# EAGLE design pcb_telemetria (EAGLE 9.4.2)
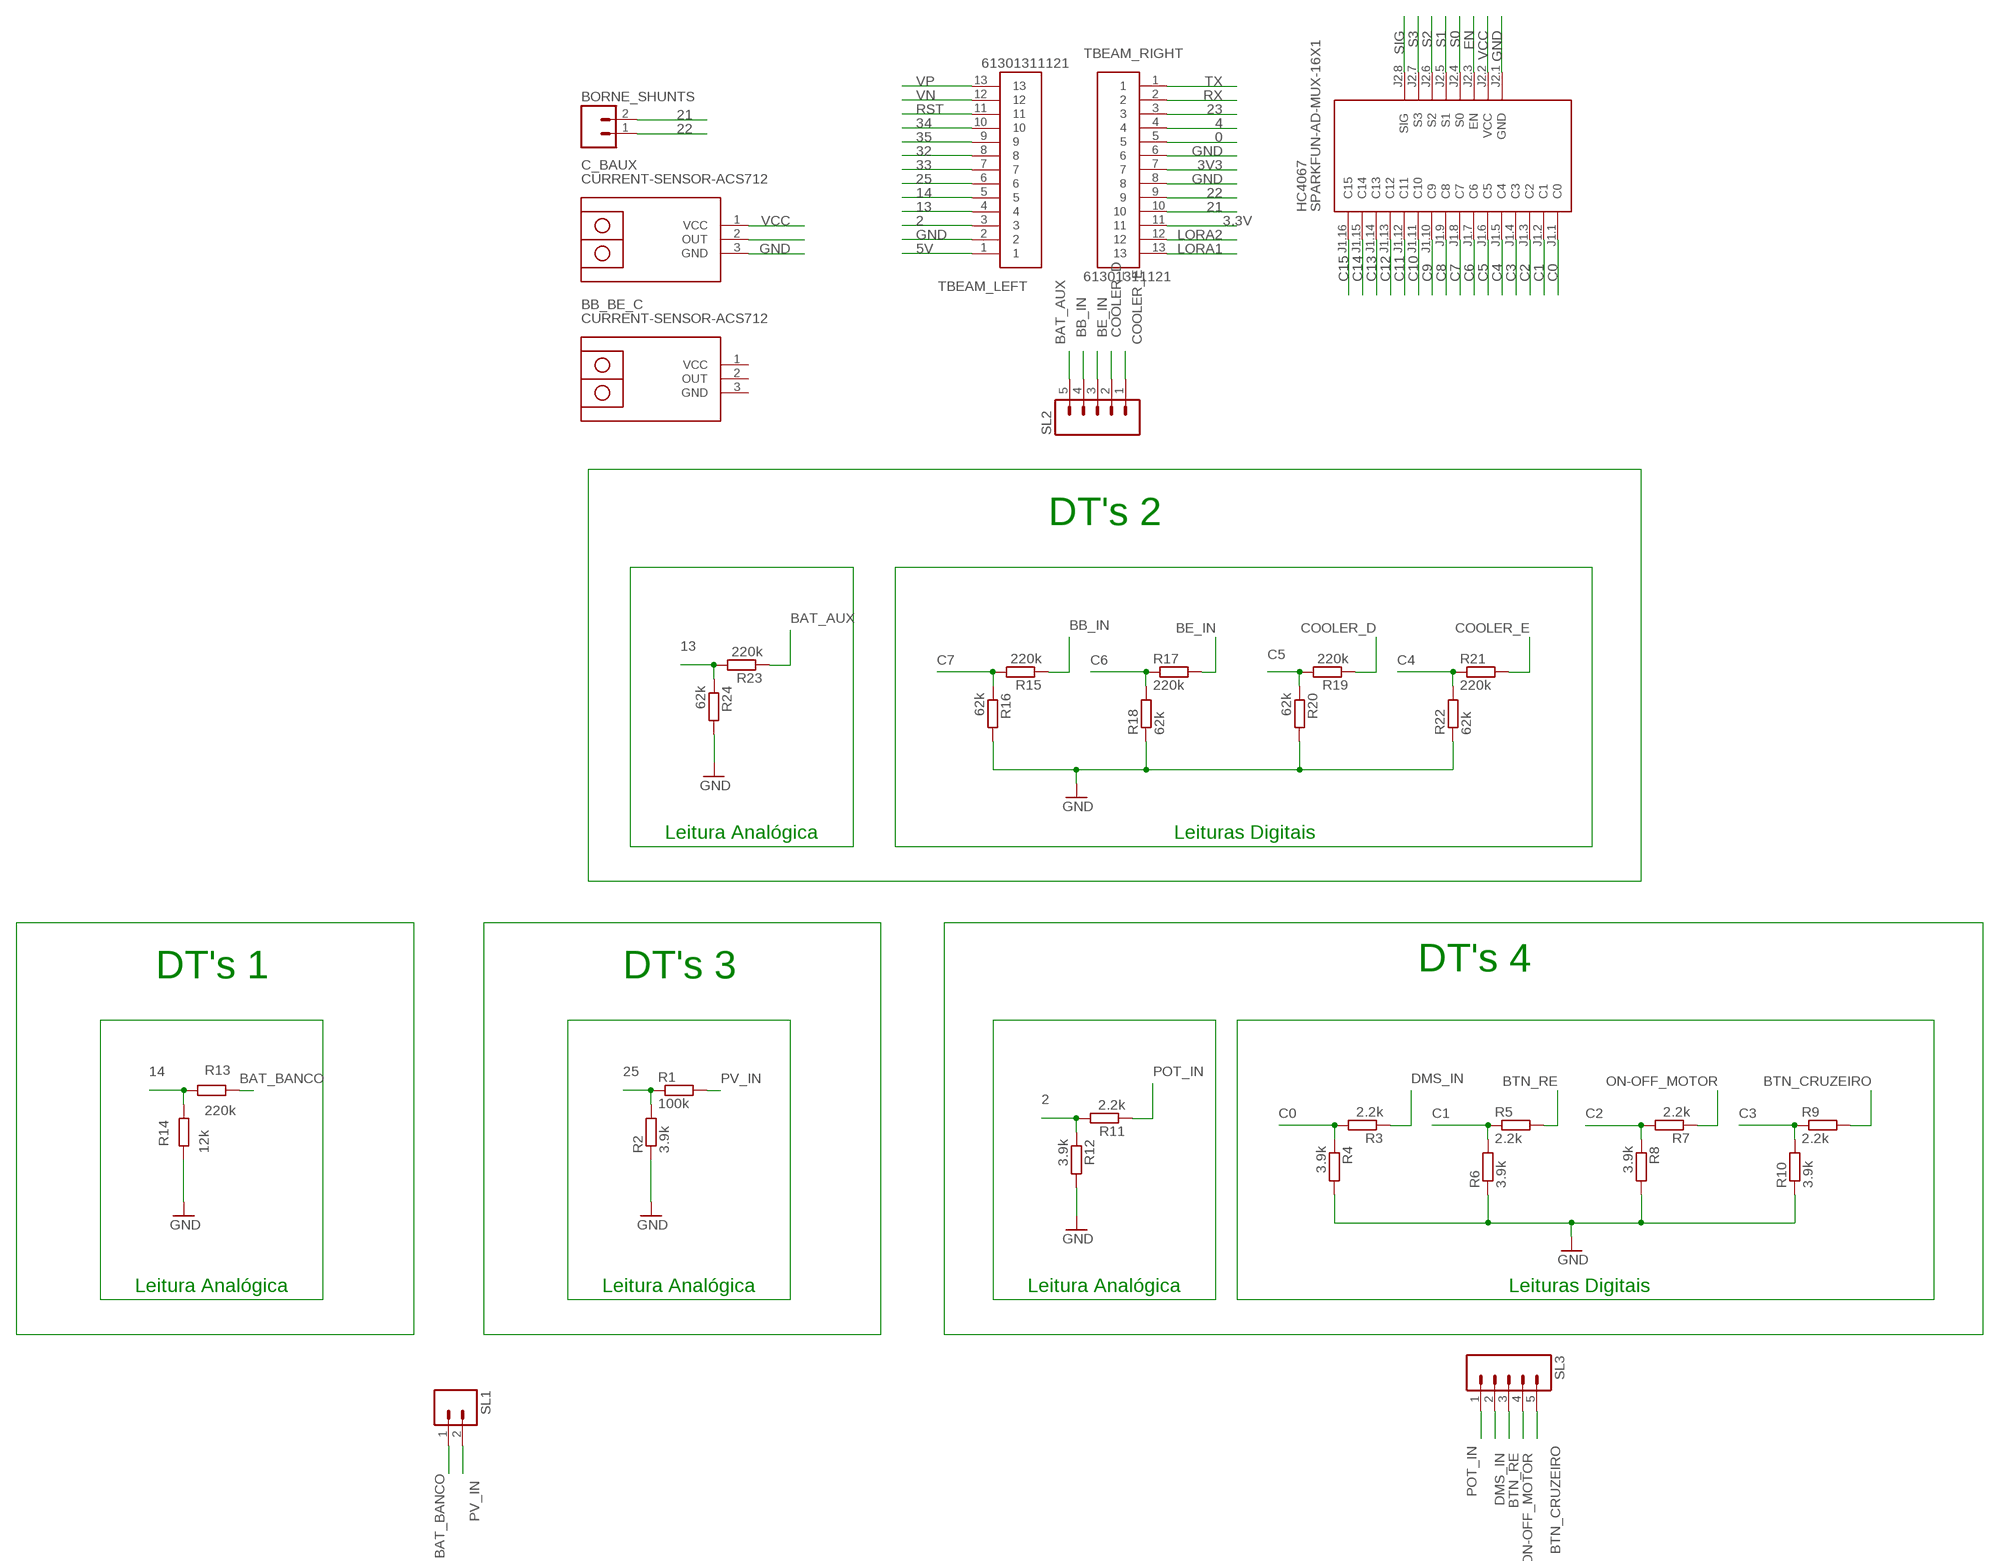
[diagram p0: schematic, sheet 1]

## Parts
BB_BE_C  CURRENT-SENSOR-ACS712  [CURRENT-SENSOR-ACS712]
BORNE_SHUNTS  M02  [02P]
C_BAUX  CURRENT-SENSOR-ACS712  [CURRENT-SENSOR-ACS712]
HC4067  SPARKFUN-AD-MUX-16X1  [SPARKFUN-AD-MUX-16X1]
R1  100k  R-EU_0204/7  [0204/7]
R2  3.9k  R-EU_0204/7  [0204/7]
R3  2.2k  R-EU_0204/7  [0204/7]
R4  3.9k  R-EU_0204/7  [0204/7]
R5  2.2k  R-EU_0204/7  [0204/7]
R6  3.9k  R-EU_0204/7  [0204/7]
R7  2.2k  R-EU_0204/7  [0204/7]
R8  3.9k  R-EU_0204/7  [0204/7]
R9  2.2k  R-EU_0204/7  [0204/7]
R10  3.9k  R-EU_0204/7  [0204/7]
R11  2.2k  R-EU_0204/7  [0204/7]
R12  3.9k  R-EU_0204/7  [0204/7]
R13  220k  R-EU_0204/7  [0204/7]
R14  12k  R-EU_0204/7  [0204/7]
R15  220k  R-EU_0204/7  [0204/7]
R16  62k  R-EU_0204/7  [0204/7]
R17  220k  R-EU_0204/7  [0204/7]
R18  62k  R-EU_0204/7  [0204/7]
R19  220k  R-EU_0204/7  [0204/7]
R20  62k  R-EU_0204/7  [0204/7]
R21  220k  R-EU_0204/7  [0204/7]
R22  62k  R-EU_0204/7  [0204/7]
R23  220k  R-EU_0204/7  [0204/7]
R24  62k  R-EU_0204/7  [0204/7]
SL1  M02  [02P]
SL2  M05  [05P]
SL3  M05  [05P]
TBEAM_LEFT  61301311121  [61301311121]
TBEAM_RIGHT  61301311121  [61301311121]

## Nets
0: TBEAM_RIGHT.5
2: R11.2 R12.1 TBEAM_LEFT.3
3.3V: TBEAM_RIGHT.11
3V3: TBEAM_RIGHT.7
4: TBEAM_RIGHT.4
5V: TBEAM_LEFT.1
13: R23.2 R24.1 TBEAM_LEFT.4
14: R13.1 R14.2 TBEAM_LEFT.5
21: BORNE_SHUNTS.2 TBEAM_RIGHT.10
22: BORNE_SHUNTS.1 TBEAM_RIGHT.9
23: TBEAM_RIGHT.3
25: R1.1 R2.2 TBEAM_LEFT.6
32: TBEAM_LEFT.8
33: C_BAUX.2(OUT) TBEAM_LEFT.7
34: TBEAM_LEFT.10
35: TBEAM_LEFT.9
BAT_AUX: R23.1 SL2.5
BAT_BANCO: R13.2 SL1.1
BB_IN: R15.1 SL2.4
BE_IN: R17.2 SL2.3
BTN_CRUZEIRO: R9.2 SL3.5
BTN_RE: R5.2 SL3.3
C0: HC4067.J1.1(C0) R3.2 R4.1
C1: HC4067.J1.2(C1) R5.1 R6.2
C2: HC4067.J1.3(C2) R7.2 R8.1
C3: HC4067.J1.4(C3) R9.1 R10.2
C4: HC4067.J1.5(C4) R21.1 R22.2
C5: HC4067.J1.6(C5) R19.2 R20.1
C6: HC4067.J1.7(C6) R17.1 R18.2
C7: HC4067.J1.8(C7) R15.2 R16.1
C8: HC4067.J1.9(C8)
C9: HC4067.J1.10(C9)
C10: HC4067.J1.11(C10)
C11: HC4067.J1.12(C11)
C12: HC4067.J1.13(C12)
C13: HC4067.J1.14(C13)
C14: HC4067.J1.15(C14)
C15: HC4067.J1.16(C15)
COOLER_D: R19.1 SL2.2
COOLER_E: R21.2 SL2.1
DMS_IN: R3.1 SL3.2
EN: HC4067.J2.3(EN)
GND: C_BAUX.3(GND) HC4067.J2.1(GND) R2.1 R4.2 R6.1 R8.2 R10.1 R12.2 R14.1 R16.2 R18.1 R20.2 R22.1 R24.2 TBEAM_LEFT.2 TBEAM_RIGHT.6 TBEAM_RIGHT.8
LORA1: TBEAM_RIGHT.13
LORA2: TBEAM_RIGHT.12
ON-OFF_MOTOR: R7.1 SL3.4
POT_IN: R11.1 SL3.1
PV_IN: R1.2 SL1.2
RST: TBEAM_LEFT.11
RX: TBEAM_RIGHT.2
S0: HC4067.J2.4(S0)
S1: HC4067.J2.5(S1)
S2: HC4067.J2.6(S2)
S3: HC4067.J2.7(S3)
SIG: HC4067.J2.8(SIG)
TX: TBEAM_RIGHT.1
VCC: C_BAUX.1(VCC) HC4067.J2.2(VCC)
VN: TBEAM_LEFT.12
VP: TBEAM_LEFT.13
Unconnected: BB_BE_C.2(OUT)

## Notes on the sheet
- DT's 2
- Leitura Analógica | Leituras Digitais
- DT's 1 | DT's 3 | DT's 4
- Leitura Analógica | Leitura Analógica | Leitura Analógica | Leituras Digitais

## Power pins joined to a net without a drawn wire
GND: BB_BE_C.3(GND)
VCC: BB_BE_C.1(VCC)

## Library data of the parts
BB_BE_C C_BAUX = diy-modules:CURRENT-SENSOR-ACS712: Isolated Bipolar Current Sensors based on ACS712 chip More details available here: http://embedded-lab.com/blog/a-brief-overview-of-allegro-acs712-current-sensor-part-1/ Click here to find device on ebay.com <http://www.ebay.com/sch/acs712+module> Note: There are many available versions with different pinout. Please check before use
BORNE_SHUNTS SL1 = con-amp-quick:M02: AMP QUICK CONNECTOR; OC_FARNELL: unknown; OC_NEWARK: unknown
HC4067 = diy-modules:SPARKFUN-AD-MUX-16X1: SparkFun Analog/Digital MUX Breakout based on CD74HC4067 chip Source: https://www.sparkfun.com/products/9056
R1-R24 = rcl:R-EU_: RESISTOR, European symbol; SPICEPREFIX: R
SL2 SL3 = con-amp-quick:M05: AMP QUICK CONNECTOR; OC_FARNELL: unknown; OC_NEWARK: unknown
TBEAM_LEFT TBEAM_RIGHT = Headers:61301311121: CONN HEADER VERT 13POS 2.54MM Manufacturer's datasheet <https://katalog.we-online.de/em/datasheet/6130xx11121.pdf>; CREATED_BY: PCBLayout.com; DIGIKEY_PART_NUMBER: 732-5324-ND; MANUFACTURER: Wurth Electronics Inc.; MPN: 61301311121

## Board
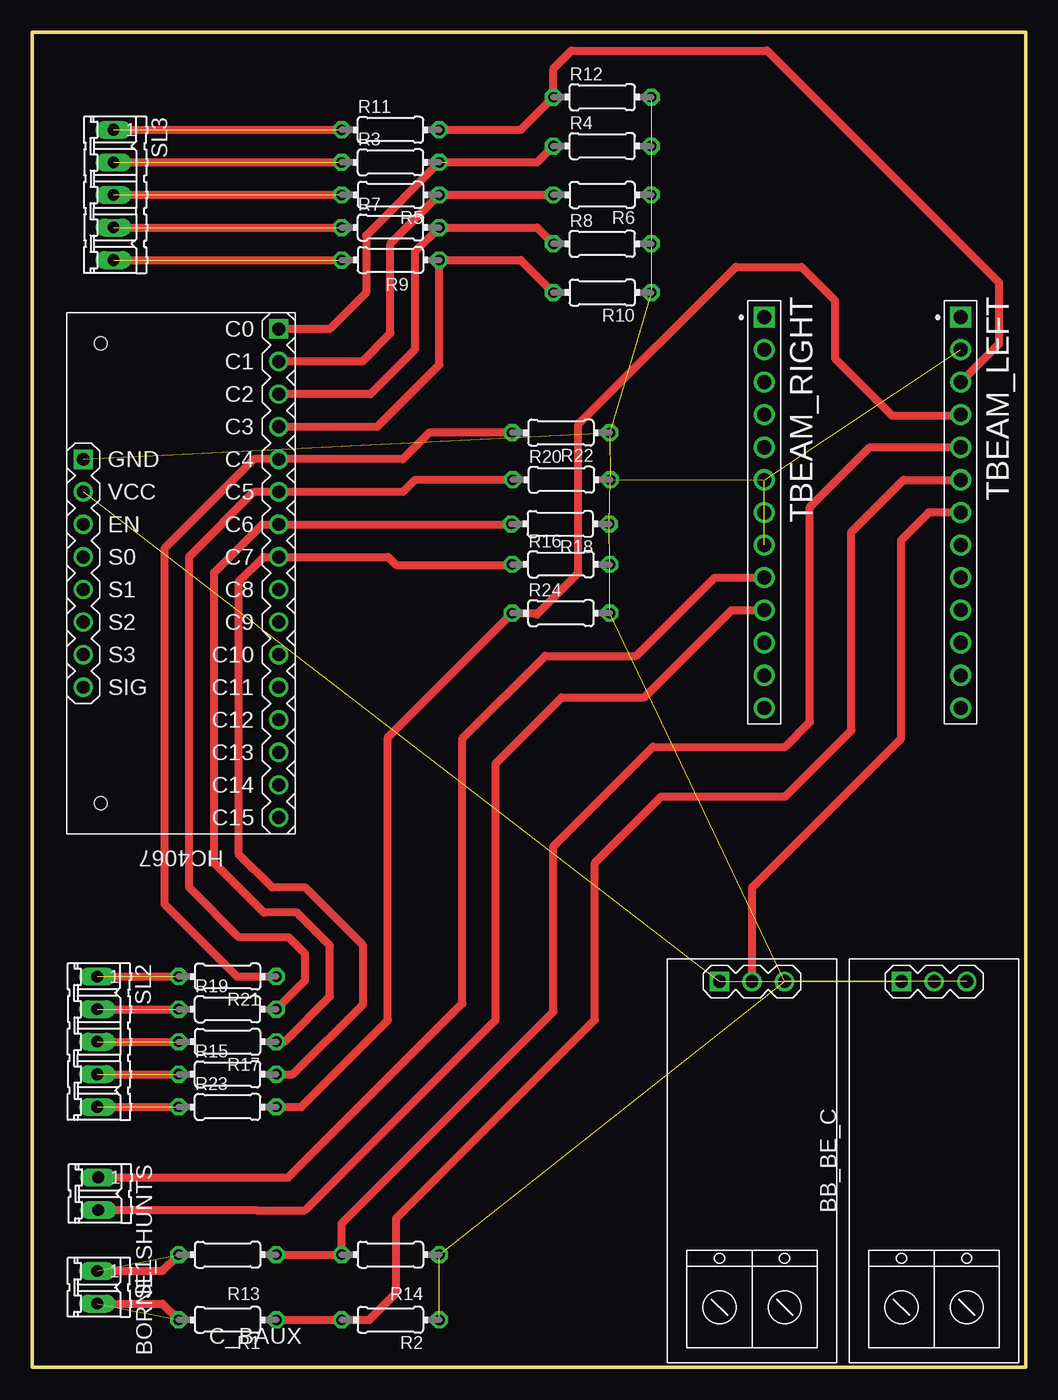
[diagram p1: board, top side]
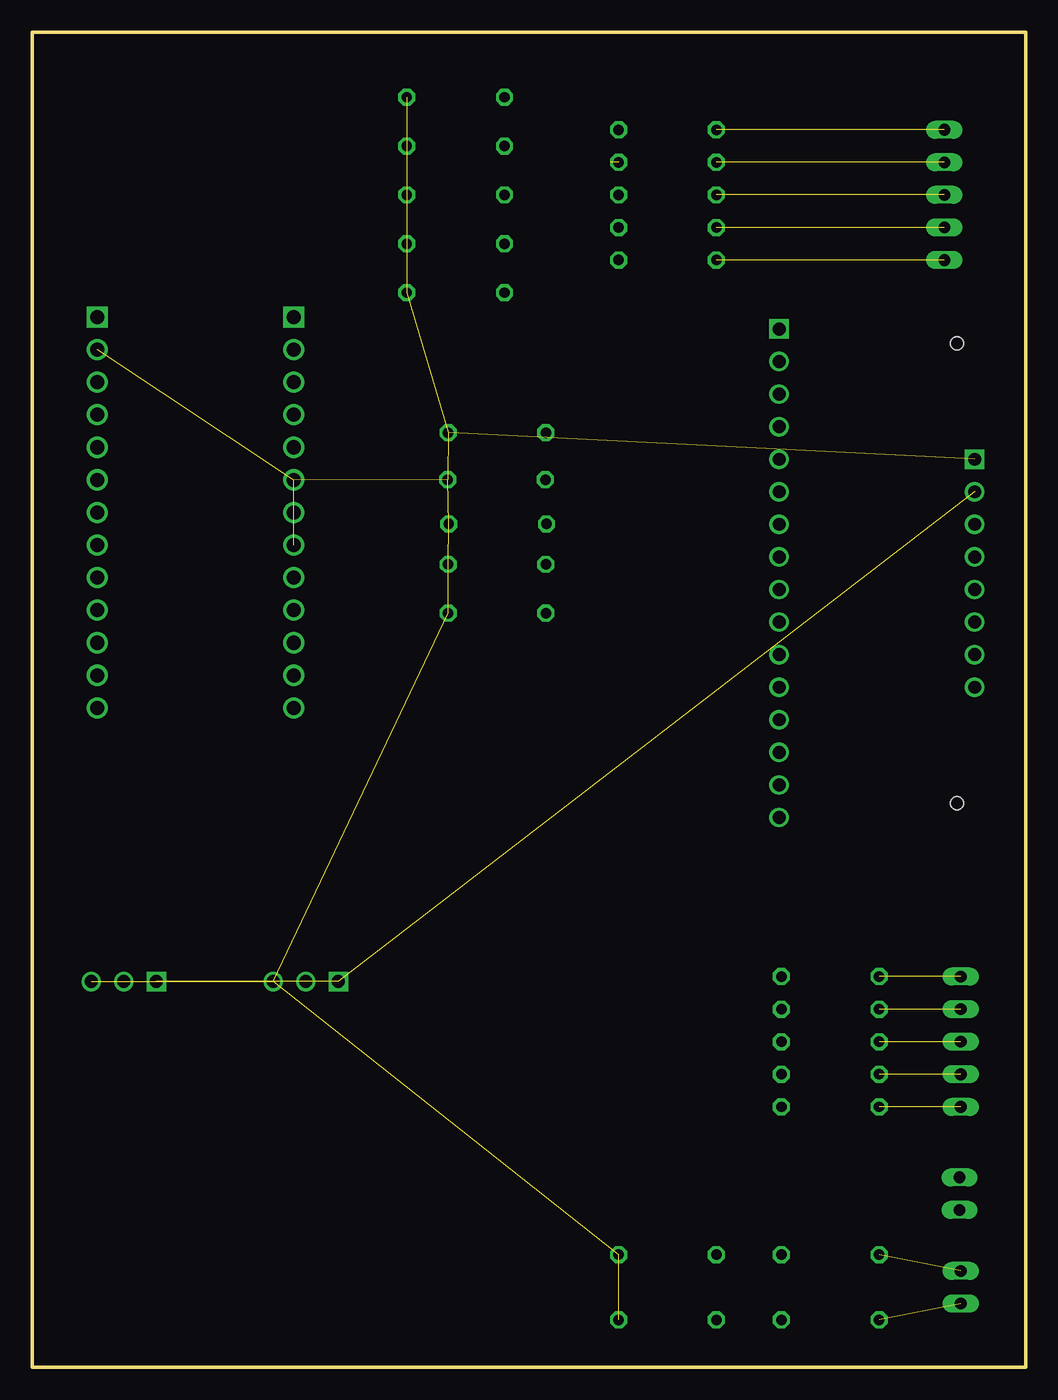
[diagram p2: board, bottom side, seen from below]

Size 77.47 x 104.14 mm. Coordinates in mm from the lower left corner, seen from the top.
Outline: 0,0 0,104.14 77.47,104.14 77.47,0 0,0
Copper layers (1*16): Top 0.035mm / dielectric 1.5mm / Bottom 0.035mm
Design rules "default *": minimum track width 6mil, minimum drill 0.35mm, track to track 24mil, track to pad 24mil, pad to pad 24mil, via to via 24mil, smd to smd 24mil, copper to edge 40mil, drill to drill 24mil, minimum pad ring 10mil, minimum via ring 8mil, stop-mask expansion 4mil, vias tented up to drill 0mil, thermal gap 10mil

### Footprints (pad centres in the part's own frame; a part is rotated, then mirrored left to right if it is on the bottom)
CURRENT-SENSOR-ACS712 = drill 1 square: 1 13.97,2.54 | drill 1: 2 13.97,0; 3 13.97,-2.54
02P = drill 0.914 long: 1 -1.27,0; 2 1.27,0
SPARKFUN-AD-MUX-16X1 = drill 1 square: J1.1 -7.62,-19.05; J2.1 7.62,-8.89 | drill 1: J1.2 -7.62,-16.51; J1.3 -7.62,-13.97; J1.4 -7.62,-11.43; J1.5 -7.62,-8.89; J1.6 -7.62,-6.35; J1.7 -7.62,-3.81; J1.8 -7.62,-1.27; J1.9 -7.62,1.27; J1.10 -7.62,3.81; J1.11 -7.62,6.35; J1.12 -7.62,8.89; J1.13 -7.62,11.43; J1.14 -7.62,13.97; J1.15 -7.62,16.51; J1.16 -7.62,19.05; J2.2 7.62,-6.35; J2.3 7.62,-3.81; J2.4 7.62,-1.27; J2.5 7.62,1.27; J2.6 7.62,3.81; J2.7 7.62,6.35; J2.8 7.62,8.89 | hole 1: 6.245,-17.93; 6.245,17.93
0204/7 = drill 0.813 octagon: 1 -3.81,0; 2 3.81,0
05P = drill 0.914 long: 1 -5.08,0; 2 -2.54,0; 3 0,0; 4 2.54,0; 5 5.08,0
61301311121 = drill 1.1 square: 1 -15.24,0 | drill 1.1: 2 -12.7,0; 3 -10.16,0; 4 -7.62,0; 5 -5.08,0; 6 -2.54,0; 7 0,0; 8 2.54,0; 9 5.08,0; 10 7.62,0; 11 10.16,0; 12 12.7,0; 13 15.24,0

### Placement (x,y rotation side)
BB_BE_C  70.32,16.13 90 top
BORNE_SHUNTS  5.16,13.55 270 top
C_BAUX  56.13,16.13 90 top
HC4067  11.61,61.94 180 top
R1  15.24,3.71 180 top
R2  27.94,3.71 180 top
R3  27.94,93.98 0 top
R4  44.45,95.25 0 top
R5  27.94,91.44 180 top
R6  44.45,91.44 180 top
R7  27.94,88.9 0 top
R8  44.45,87.63 0 top
R9  27.94,86.36 180 top
R10  44.45,83.82 180 top
R11  27.94,96.52 0 top
R12  44.45,99.06 0 top
R13  15.24,8.79 180 top
R14  27.94,8.79 180 top
R15  15.24,22.86 0 top
R16  41.23,62.63 0 top
R17  15.24,25.4 180 top
R18  41.18,65.78 180 top
R19  15.24,27.94 0 top
R20  41.27,69.23 0 top
R21  15.24,30.48 180 top
R22  41.23,72.9 180 top
R23  15.24,20.32 0 top
R24  41.23,58.82 0 top
SL1  5.08,6.25 270 top
SL2  5.08,25.4 270 top
SL3  6.35,91.44 270 top
TBEAM_LEFT  72.39,66.67 270 top
TBEAM_RIGHT  57.08,66.67 270 top

### Tracks (layer width: path | path; a pad name or v marks a point on that pad's centre or on a via)
2
  Top 0.61: R11.2 38.1,96.52 R12.1 40.64,101.28 42.05,102.69 57.31,102.69 75.38,84.62 75.38,79.82 TBEAM_LEFT.3
13
  Top 0.61: R23.2 20.98,20.32 27.74,27.08 27.74,49.14 R24.1 39.24,58.82 39.35,58.71 42.58,61.94 42.58,73.55 54.84,85.81 60,85.81 62.58,83.23 62.58,78.71 67.1,74.19 72.29,74.19 TBEAM_LEFT.4
14
  Top 0.61: TBEAM_LEFT.5 65.3,71.75 60.65,67.1 60.65,50.32 58.71,48.39 48.39,48.39 40.65,40.65 40.65,27.74 24.13,11.23 R14.2 R13.1
21
  Top 0.61: BORNE_SHUNTS.2 17.4,12.28 17.42,12.26 21.29,12.26 36.13,27.1 36.13,47.1 41.29,52.26 47.74,52.26 54.54,59.05 TBEAM_RIGHT.10
22
  Top 0.61: BORNE_SHUNTS.1 19.98,14.82 33.55,28.39 33.55,49.03 40,55.48 47.1,55.48 53.21,61.59 TBEAM_RIGHT.9
25
  Top 0.61: TBEAM_LEFT.6 67.92,69.22 63.87,65.16 63.87,49.68 58.71,44.52 49.03,44.52 43.87,39.35 43.87,27.1 28.39,11.61 28.39,5.81 26.29,3.71 R2.2 R1.1
33
  Top 0.61: C_BAUX.2 56.13,37.42 67.74,49.03 67.74,64.52 69.9,66.67 TBEAM_LEFT.7
BAT_AUX  (1 unrouted)
  Top 0.61: 4.45,20.32 R23.1
BAT_BANCO  (1 unrouted)
  Top 0.61: SL1.1 10.16,7.52 R13.2
BB_IN  (1 unrouted)
  Top 0.61: SL2.4 R15.1
BE_IN  (1 unrouted)
  Top 0.61: SL2.3 R17.2
BTN_CRUZEIRO  (1 unrouted)
  Top 0.61: SL3.5 R9.2
BTN_RE  (1 unrouted)
  Top 0.61: SL3.3 R5.2
C0  (1 unrouted)
  Top 0.61: 32.38,93.98 39.37,93.98 R4.1 | R3.2 26.04,88.27 26.04,83.82 23.2,80.98 HC4067.J1.1
C1
  Top 0.61: R6.2 R5.1 27.94,87.63 27.94,80.64 25.74,78.44 HC4067.J1.2
C2
  Top 0.61: R8.1 39.37,88.9 R7.2 29.84,87 29.84,79.38 26.38,75.91 HC4067.J1.3
C3
  Top 0.61: R10.2 38.1,86.36 R9.1 31.75,78.2 26.91,73.36 HC4067.J1.4
C4
  Top 0.61: R21.1 15.97,30.48 10.32,36.13 10.32,63.85 17.3,70.83 HC4067.J1.5 28.89,70.83 30.96,72.9 R22.2
C5
  Top 0.61: R19.2 21.29,30.18 21.29,32.26 20,33.55 16.13,33.55 12.26,37.42 12.26,63.25 17.3,68.28 HC4067.J1.6 28.93,68.28 29.87,69.22 R20.1
C6
  Top 0.61: R17.1 19.7,25.4 23.23,28.93 23.23,32.9 20.64,35.48 18.06,35.48 14.19,39.35 14.19,62 17.94,65.75 HC4067.J1.7 37.34,65.75 R18.2
C7
  Top 0.61: R15.2 20.34,22.86 25.81,28.33 25.81,32.9 21.29,37.42 18.71,37.42 16.13,40 16.13,61.29 18.04,63.2 HC4067.J1.8 27.76,63.2 28.39,62.58 37.37,62.58 R16.1
COOLER_D  (1 unrouted)
  Top 0.61: SL2.2 R19.1
COOLER_E  (1 unrouted)
  Top 0.61: SL2.1 R21.2
DMS_IN  (1 unrouted)
  Top 0.61: SL3.2 R3.1
GND  (17 unrouted)
  Top 0.152: 48.39,95.25 R4.2
  Bottom 0.152: 48.39,99.06 R12.2
ON-OFF_MOTOR  (1 unrouted)
  Top 0.61: 5.71,88.9 R7.1
POT_IN  (1 unrouted)
  Top 0.61: SL3.1 R11.1
PV_IN  (1 unrouted)
  Top 0.152: 11.43,3.83 R1.2
  Top 0.61: SL1.2 10.16,4.98 R1.2
VCC  (2 unrouted)